# EAGLE design napajeniMOB (EAGLE 6.5.0)
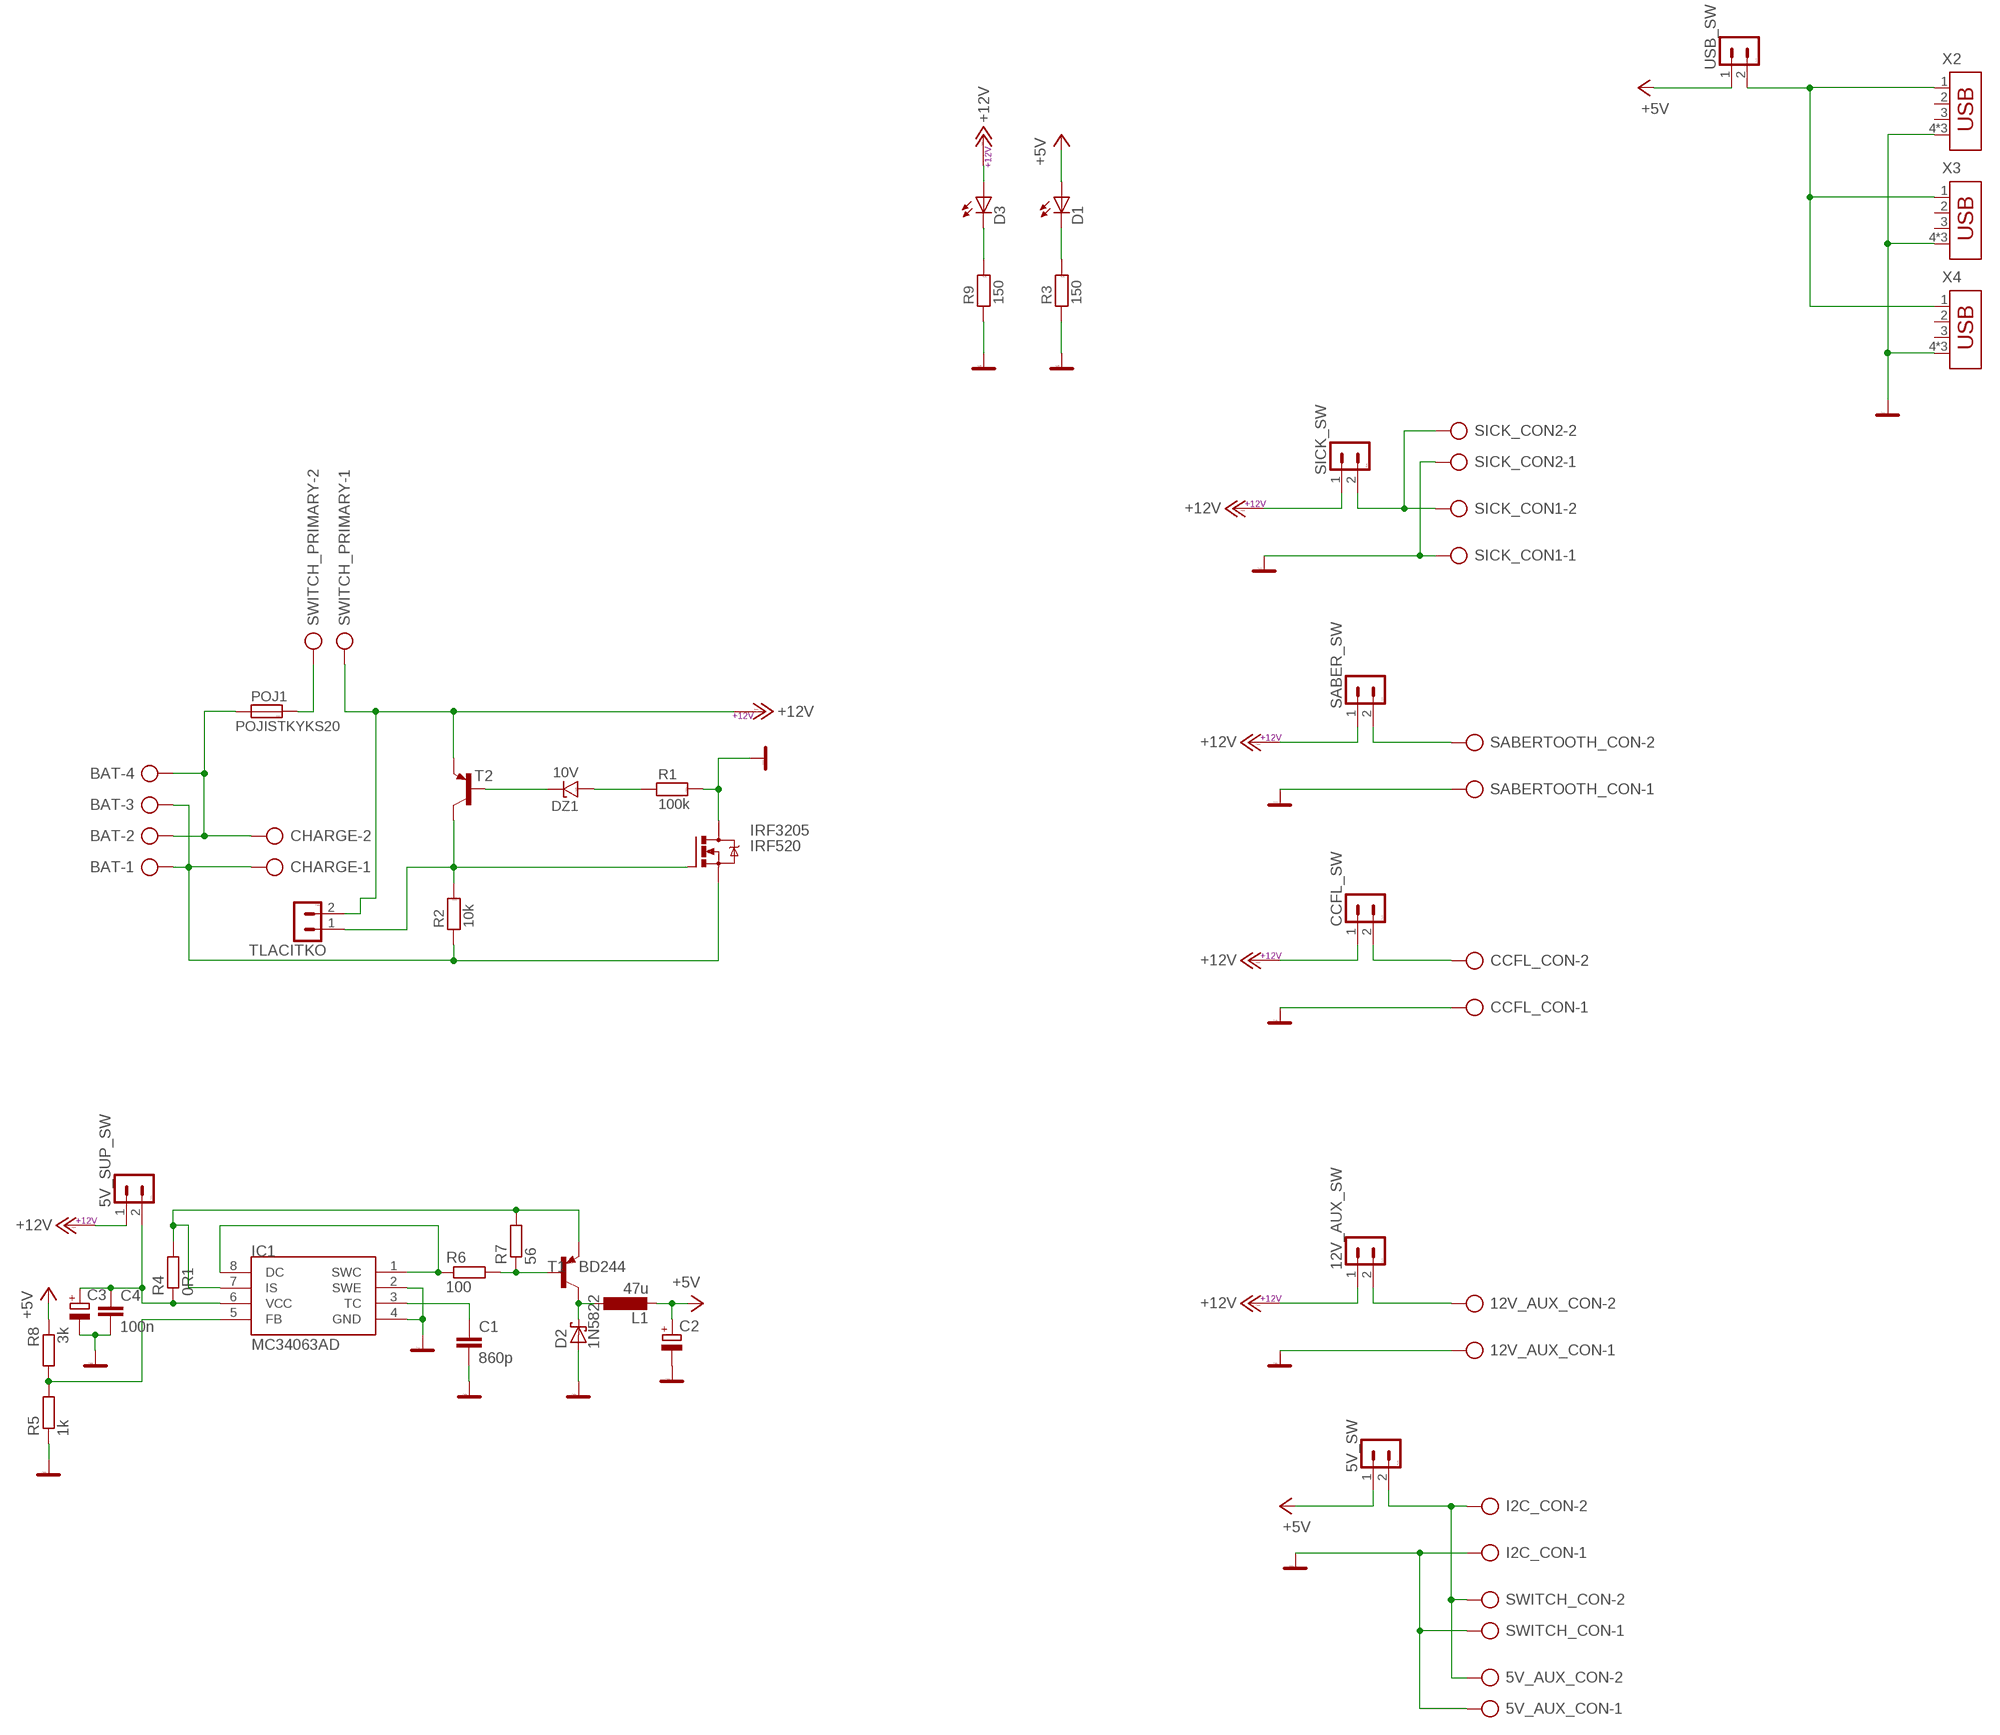
[diagram p0: schematic, sheet 1]

## Parts
5V_AUX_CON  AK500/2  [AK500/2]
5V_SUP_SW  PSH02-02P  [PSH02-02P]
5V_SW  PSH02-02P  [PSH02-02P]
12V_AUX_CON  AK500/2  [AK500/2]
12V_AUX_SW  PSH02-02P  [PSH02-02P]
BAT  AK500/4  [AK500/4]
C1  860p  C-EUC0805  [C0805]
C2  CPOL-EUE5-8.5  [E5-8,5]
C3  CPOL-EUE5-8.5  [E5-8,5]
C4  100n  C-EUC0805  [C0805]
CCFL_CON  AK500/2  [AK500/2]
CCFL_SW  PSH02-02P  [PSH02-02P]
CHARGE  AK500/2  [AK500/2]
D1  LED3MM  [LED3MM]
D2  1N5822  1N5817-B  [DO41-7.6]
D3  LED3MM  [LED3MM]
DZ1  10V  D-ZENEROVA_0,5W_BZV55C_SMD  [SOD-80]
I2C_CON  AK500/2  [AK500/2]
IC1  MC34063AD  [SOIC8]
IRF3205  IRF520  [TO220BV]
L1  47u  L-EUTJ3-U1  [TJ3-U1]
POJ1  POJISTKYKS20  [POJ_KS20]
R1  100k  R_SMD_0805  [0805]
R2  10k  R_SMD_0805  [0805]
R3  150  R_SMD_0805  [0805]
R4  0R1  R-EU_M0805  [M0805]
R5  1k  R-EU_M0805  [M0805]
R6  100  R-EU_M0805  [M0805]
R7  56  R-EU_M0805  [M0805]
R8  3k  R-EU_M0805  [M0805]
R9  150  R_SMD_0805  [0805]
SABER_SW  PSH02-02P  [PSH02-02P]
SABERTOOTH_CON  AK500/2  [AK500/2]
SICK_CON1  AK500/2  [AK500/2]
SICK_CON2  AK500/2  [AK500/2]
SICK_SW  PSH02-02P  [PSH02-02P]
SWITCH_CON  AK500/2  [AK500/2]
SWITCH_PRIMARY  AK500/2  [AK500/2]
T1  BD244  [TO220]
T2  BC807-16-PNP-SOT23-BEC  [SOT23-BEC]
TLACITKO  PSH02-02P  [PSH02-02P]
USB_SW  PSH02-02P  [PSH02-02P]
X2  USB-787616GROUNDED  [USBGROUNDED]
X3  USB-787616GROUNDED  [USBGROUNDED]
X4  USB-787616GROUNDED  [USBGROUNDED]

## Nets
+5V: 5V_SW.1 C2.+ D1.A L1.2 R8.1 USB_SW.1
+12V: 5V_SUP_SW.1 12V_AUX_SW.1 CCFL_SW.1 D3.A SABER_SW.1 SICK_SW.1 SWITCH_PRIMARY.1 T2.E TLACITKO.2
GND: 5V_AUX_CON.1 12V_AUX_CON.1 C1.2 C2.- C3.- C4.2 CCFL_CON.1 D2.A I2C_CON.1 IC1.2(SWE) IC1.4(GND) IRF3205.D R1.2 R3.1 R5.1 R9.1 SABERTOOTH_CON.1 SICK_CON1.1 SICK_CON2.1 SWITCH_CON.1 X2.4 X2.S1 X2.S2 X3.4 X3.S1 X3.S2 X4.4 X4.S1 X4.S2
GND_BATERIE: BAT.1 BAT.3 CHARGE.1 IRF3205.S R2.1
N$1: DZ1.A R1.1
N$2: BAT.2 BAT.4 CHARGE.2 POJ1.1
N$3: DZ1.K T2.B
N$4: POJ1.2 SWITCH_PRIMARY.2
N$5: IRF3205.G R2.2 T2.C TLACITKO.1
N$6: 5V_SUP_SW.2 C3.+ C4.1 IC1.6(VCC) R4.1
N$7: D3.K(C) R9.2
N$8: D1.K(C) R3.2
N$9: SICK_CON1.2 SICK_CON2.2 SICK_SW.2
N$10: USB_SW.2 X2.1 X3.1 X4.1
N$11: SABER_SW.2 SABERTOOTH_CON.2
N$12: CCFL_CON.2 CCFL_SW.2
N$13: D2.C L1.1 T1.2(C)
N$15: 12V_AUX_CON.2 12V_AUX_SW.2
N$16: 5V_AUX_CON.2 5V_SW.2 I2C_CON.2 SWITCH_CON.2
N$17: IC1.5(FB) R5.2 R8.2
N$18: IC1.7(IS) R4.2 R7.2 T1.3(E)
N$19: IC1.1(SWC) IC1.8(DC) R6.1
N$20: R6.2 R7.1 T1.1(B)
N$22: C1.1 IC1.3(TC)
Unconnected: X2.2 X2.3 X3.2 X3.3 X4.2 X4.3

## Library data of the parts
5V_AUX_CON 12V_AUX_CON CCFL_CON CHARGE I2C_CON SABERTOOTH_CON SICK_CON1 SICK_CON2 SWITCH_CON SWITCH_PRIMARY = #Svorkovnice:AK500/2: CONNECTOR
5V_SUP_SW 5V_SW 12V_AUX_SW CCFL_SW SABER_SW SICK_SW TLACITKO USB_SW = #PaJa_konektory:PSH02-02: Konektory se zamkem - vidlice - 2pin
BAT = #Svorkovnice:AK500/4: CONNECTOR
C1 C4 = rcl:C-EU: CAPACITOR, European symbol
C2 C3 = rcl:CPOL-EU: POLARIZED CAPACITOR, European symbol
D1 D3 = led:LED: LED OSRAM: - CHIPLED LG R971, LG N971, LY N971, LG Q971, LY Q971, LO R971, LY R971 LH N974, LH R974 LS Q976, LO Q976, LY Q976 LO Q996 - Hyper CHIPLED LW Q18S LB Q993, LB Q99A, LB R99A - SideLED LS A670, LO A670, LY A670, LG A670, LP A670 LB A673, LV A673, LT A673, LW A673 LH A674 LY A675 LS A676, LA A676, LO A676, LY A676, LW A676 LS A679, LY A679, LG A679 - Hyper Micro SIDELED® LS Y876, LA Y876, LO Y876, LY Y876 LT Y87S - SmartLED LW L88C, LW L88S LB L89C, LB L89S, LG L890 LS L89K, LO L89K, LY L89K LS L896, LA L896, LO L896, LY L896 - TOPLED LS T670, LO T670, LY T670, LG T670, LP T670 LSG T670, LSP T670, LSY T670, LOP T670, LYG T670 LG T671, LOG T671, LSG T671 LB T673, LV T673, LT T673, LW T673 LH T674 LS T676, LA T676, LO T676, LY T676, LB T676, LH T676, LSB T676, LW T676 LB T67C, LV T67C, LT T67C, LS T67K, LO T67K, LY T67K, LW E67C LS E67B, LA E67B, LO E67B, LY E67B, LB E67C, LV E67C, LT E67C LW T67C LS T679, LY T679, LG T679 LS T770, LO T770, LY T770, LG T770, LP T770 LB T773, LV T773, LT T773, LW T773 LH T774 LS E675, LA E675, LY E675, LS T675 LS T776, LA T776, LO T776, LY T776, LB T776 LHGB T686 LT T68C, LB T68C - Hyper Mini TOPLED® LB M676 - Mini TOPLED Santana® LG M470 LS M47K, LO M47K, LY M47K Source: http://www.osram.convergy.de LUXEON: - LUMILED® LXK2-PW12-R00, LXK2-PW12-S00, LXK2-PW14-U00, LXK2-PW14-V00 LXK2-PM12-R00, LXK2-PM12-S00, LXK2-PM14-U00 LXK2-PE12-Q00, LXK2-PE12-R00, LXK2-PE12-S00, LXK2-PE14-T00, LXK2-PE14-U00 LXK2-PB12-K00, LXK2-PB12-L00, LXK2-PB12-M00, LXK2-PB14-N00, LXK2-PB14-P00, LXK2-PB14-Q00 LXK2-PR12-L00, LXK2-PR12-M00, LXK2-PR14-Q00, LXK2-PR14-R00 LXK2-PD12-Q00, LXK2-PD12-R00, LXK2-PD12-S00 LXK2-PH12-R00, LXK2-PH12-S00 LXK2-PL12-P00, LXK2-PL12-Q00, LXK2-PL12-R00 Source: www.luxeon.com KINGBRIGHT: KA-3528ASYC Source: www.kingbright.com
D2 = diode:1N581*: 1.0A SCHOTTKY BARRIER RECTIFIER Source: http://www.diodes.com/datasheets/ds23001.pdf
DZ1 = #PaJa_30:D-ZENEROVA: Zenerova dioda
IC1 = mc34063:MC34063
IRF3205 = transistor-power:IRF520: HEXFET Power MOSFET
L1 = rcl:L-EU: INDUCTOR, European symbol
POJ1 = #PaJa_30:POJISTKY: Pojistkove pouzdro
R1-R3 R9 = #PaJa_30:R: Rezistor
R4-R8 = rcl:R-EU_: RESISTOR, European symbol
T1 = transistor:BD244: PNP TRANSISTOR Source: Motorola Semiconductor, Master Selection Guide Q3/95 SG73 REV 8 page 5.5-5
T2 = transistor:*-PNP-: PNP Transistror
X2-X4 = D-USBcon:USB-787616GROUNDED: AMP connector

## Board
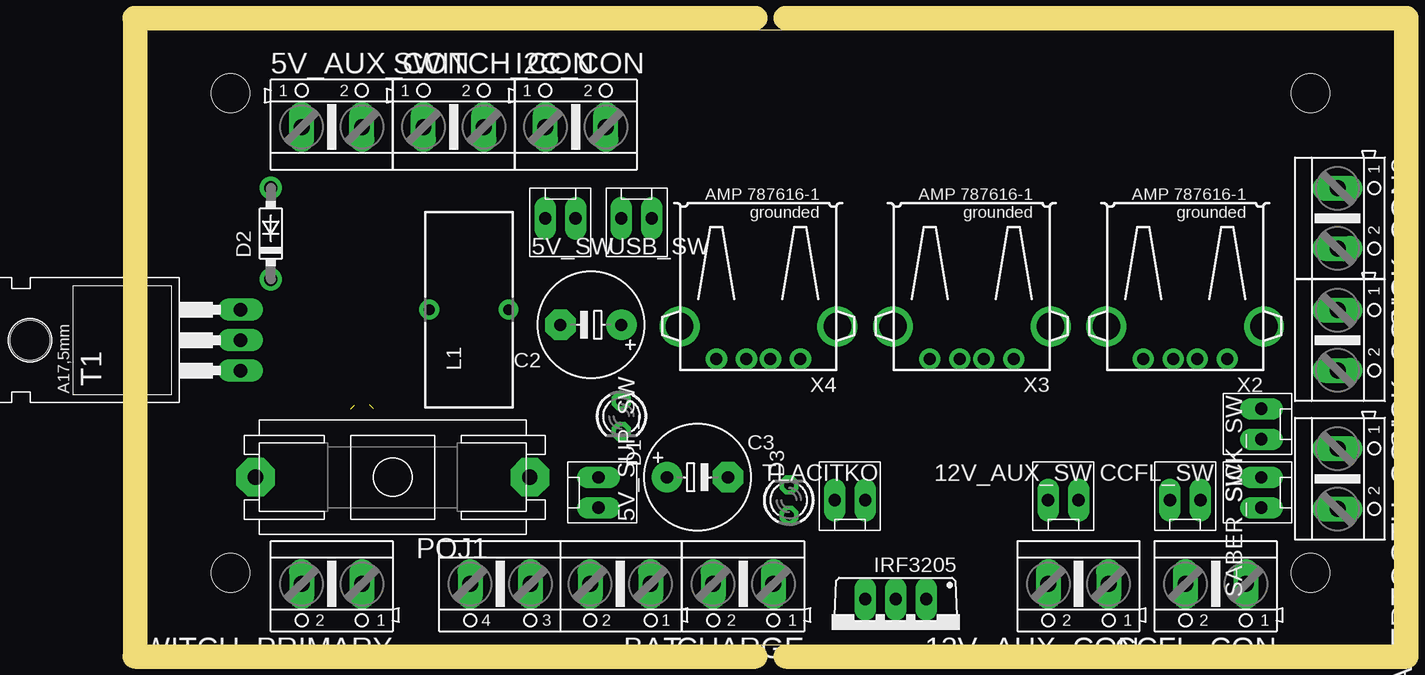
[diagram p1: board, top side]
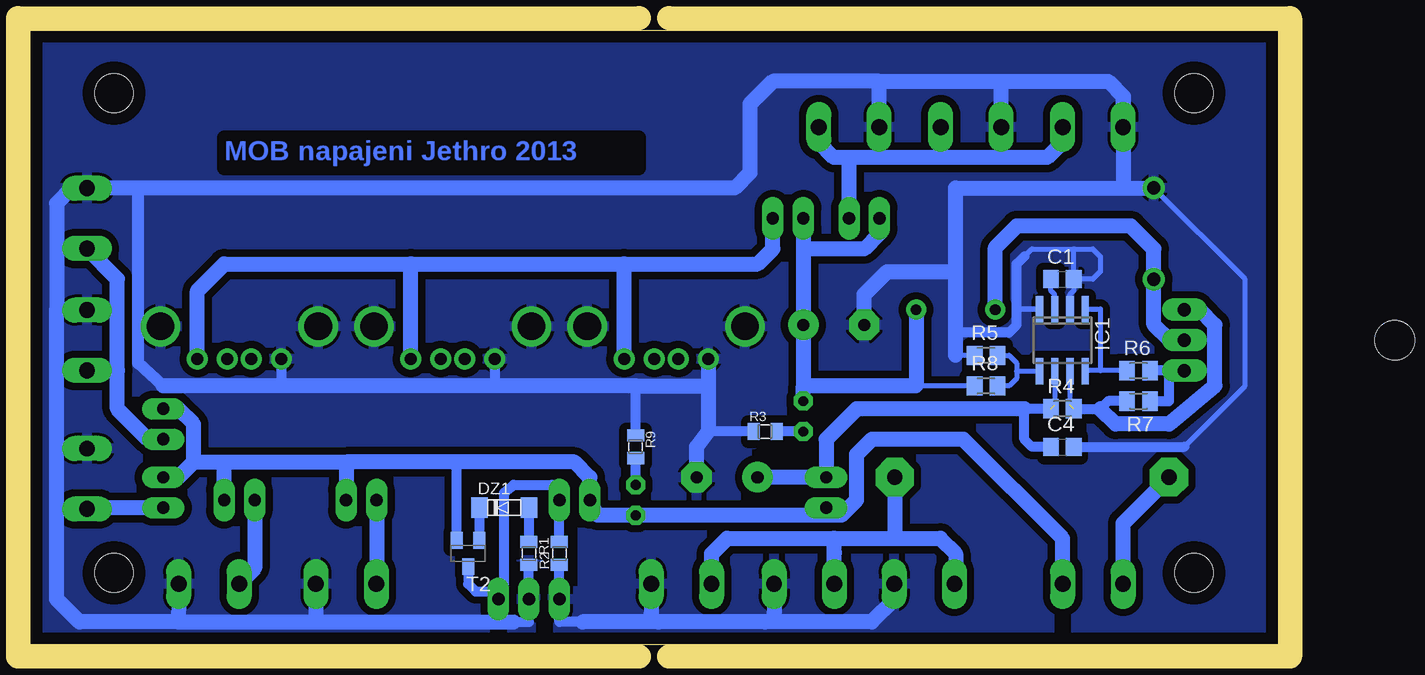
[diagram p2: board, bottom side, seen from below]

Size 104 x 51.27 mm. Coordinates in mm from the lower left corner, seen from the top.
Outline: 0,0 104,0 104,51.27 0,51.27 0,0
Copper layers (1*16): Top 0.035mm / dielectric 1.5mm / Bottom 0.035mm
Design rules "default *": minimum track width 10mil, minimum drill 24mil, track to track 8mil, track to pad 8mil, pad to pad 8mil, via to via 8mil, smd to smd 8mil, copper to edge 40mil, drill to drill 8mil, minimum pad ring 15mil, minimum via ring 8mil, stop-mask expansion 4mil, vias tented up to drill 0mil, thermal gap 10mil
Holes 3.2 mm at 7,6 97,6 97,46 7,46
bRestrict: area 41.3,17 to 44.1,18.5; area 52.8,15.1 to 54.3,17.9; area 22.7,23.2 to 25.7,25; area 22.8,20.7 to 25.8,22.5; area 61.1,5.1 to 63.7,6.4; area 53.3,39.8 to 87.8,42.3; area 16.4,15.6 to 19.5,17.4; area 61,0.6 to 61.2,3.2; area 17.8,0.6 to 18,3.2; 1 lines
Milling: 6 lines

### Footprints (pad centres in the part's own frame; a part is rotated, then mirrored left to right if it is on the bottom)
AK500/2 = drill 1.321 long: 1 -2.515,0; 2 2.515,0
PSH02-02P = drill 1.016 pad 1.422 long: 1 -1.27,0; 2 1.27,0
AK500/4 = drill 1.321 long: 1 -7.518,0; 2 -2.489,0; 3 2.489,0; 4 7.518,0
C0805 = smd 1.3 x 1.5: 1 -0.95,0; 2 0.95,0
E5-8,5 = drill 1.016 pad 2.54: + -2.54,0 | drill 1.016 pad 2.54 octagon: - 2.54,0
LED3MM = drill 0.813 octagon: A -1.27,0; K 1.27,0
DO41-7.6 = drill 1.1 pad 1.7: A 3.81,0; C -3.81,0
SOD-80 = smd 1.397 x 1.702: A 1.905,0; K -2.223,0
SOIC8 = smd 0.6 x 2.2: 1 -1.905,-2.6; 2 -0.635,-2.6; 3 0.635,-2.6; 4 1.905,-2.6; 5 1.905,2.6; 6 0.635,2.6; 7 -0.635,2.6; 8 -1.905,2.6
TO220BV = drill 1.016 long: D 0,-2.54; G -2.54,-2.54; S 2.54,-2.54
TJ3-U1 = drill 0.9: 1 -3.3,0; 2 3.3,0
POJ_KS20 = drill 1.27 pad 3.2 octagon: 1 -11.43,0; 2 11.43,0
0805 = smd 1.016 x 1.422: 1 -0.953,0; 2 0.953,0
M0805 = smd 1.3 x 1.6: 1 -0.95,0; 2 0.95,0
TO220 = drill 1.118 long: 1 -2.54,-6.35; 2 0,-6.35; 3 2.54,-6.35 | hole 3.302: 0,11.176
SOT23-BEC = smd 1 x 1.4: B -0.95,-1.1; C 0,1.1; E 0.95,-1.1
USBGROUNDED = drill 1: 1 -3.5,12.99; 2 -1,12.99; 3 1,12.99; 4 3.5,12.99 | drill 2.3: S1 -6.57,10.28; S2 6.57,10.28

### Placement (x,y rotation side)
5V_AUX_CON  15.43,43.18 0 top
5V_SUP_SW  37.66,12.7 90 top
5V_SW  34.48,35.56 0 top
12V_AUX_CON  77.66,5.08 180 top
12V_AUX_SW  76.39,12.07 180 top
BAT  34.48,5.08 180 top
C1  17.97,30.48 0 bottom
C2  37.02,26.67 180 top
C3  45.91,13.97 0 top
C4  17.97,16.51 0 bottom
CCFL_CON  89.09,5.08 180 top
CCFL_SW  86.55,12.07 180 top
CHARGE  49.72,5.08 180 top
D1  39.56,19.05 270 top
D2  10.35,34.29 90 top
D3  53.53,12.07 90 top
DZ1  64.32,11.43 0 bottom
I2C_CON  35.75,43.18 0 top
IC1  17.97,25.4 180 bottom
IRF3205  62.42,1.27 180 top
L1  26.86,27.94 0 top
POJ1  20.51,13.97 180 top
R1  62.42,7.62 270 bottom
R2  59.88,7.62 90 bottom
R3  42.73,17.78 0 bottom
R4  17.97,19.69 0 bottom
R5  24.32,24.13 0 bottom
R6  11.62,22.86 0 bottom
R7  11.62,20.32 180 bottom
R8  24.32,21.59 0 bottom
R9  53.53,16.51 270 bottom
SABER_SW  92.9,12.7 270 top
SABERTOOTH_CON  99.25,13.84 270 top
SICK_CON1  99.25,25.4 270 top
SICK_CON2  99.25,35.56 270 top
SICK_SW  92.9,18.41 270 top
SWITCH_CON  25.59,43.18 0 top
SWITCH_PRIMARY  15.43,5.08 180 top
T1  1.46,25.4 90 top
T2  67.5,7.62 180 bottom
TLACITKO  58.61,12.07 180 top
USB_SW  40.83,35.56 0 top
X2  86.55,36.83 180 top
X3  68.77,36.83 180 top
X4  50.99,36.83 180 top

### Tracks (layer width: path | path; a pad name or v marks a point on that pad's centre or on a via)
+5V
  Bottom 0.406: R8.1 31.3,21.59
  Bottom 1.27: 5V_SW.1 33.21,34.29 34.48,33.02 39.56,33.02 | USB_SW.1 39.56,33.02 | 39.56,33.02 C2.+ 39.56,21.59 | D1.A 39.56,21.59 | 39.56,21.59 31.3,21.59 30.16,21.59 L1.2
+12V
  Bottom 0.406: 5V_SUP_SW.1 37.02,10.8
  Bottom 0.813: T2.E 68.45,14.93 68.77,15.24
  Bottom 1.27: 90.36,15.24 87.82,15.24 | 87.82,15.24 77.66,15.24 | 77.66,15.24 12V_AUX_SW.1 | CCFL_SW.1 87.82,15.24 | SABER_SW.1 91.63,13.97 90.36,15.24 | 77.66,15.24 68.77,15.24 58.61,15.24 57.34,13.97 TLACITKO.2 56.71,10.8 D3.A 37.02,10.8 36.38,10.8 35.12,12.07 35.12,15.88 33.84,17.14 26.23,17.14 17.95,8.86 SWITCH_PRIMARY.1 | 90.36,15.24 90.36,18.41 91.63,19.69 SICK_SW.1
GND
  Bottom 0.406: R5.1 26.86,24.13 | IC1.2 17.34,29.21 17.02,29.52 C1.2 17.02,33.02 | 16.7,30.48 15.43,30.48 14.8,31.12 14.8,32.38 15.43,33.02 17.02,33.02 | 21.78,31.75 20.51,33.02 17.02,33.02 | 7.81,16.51 2.73,21.59 2.73,30.48 D2.A | IC1.4 21.72,28 21.78,27.94 19.88,27.94 IC1.4
  Bottom 0.813: R1.2 IRF3205.D 62.42,1.91 63.69,1.91 | 21.14,32.38 21.78,31.75 21.78,27.94 21.78,26.67 22.41,26.04 26.86,26.04 | X3.4 65.27,21.91 | X2.4 83.05,21.91 83.38,21.59 | R3.1 47.49,17.78 | C4.2 7.81,16.51 | R9.1 53.53,21.59
  Bottom 1.016: 92.9,21.59 95,23.5 95,38.1
  Bottom 1.27: 91.63,1.91 91.6,3.79 CCFL_CON.1 91.6,3.83 91.63,1.91 | 91.63,1.91 80.2,1.91 | 80.2,3.81 80.2,1.91 | 80.2,1.91 63.69,1.91 | SICK_CON1.1 100.5,27.91 100.52,27.94 101.79,27.94 | C2.- 34.48,29.21 32.58,31.12 26.86,31.12 | 26.86,31.12 26.86,38.1 12.89,38.1 | SABERTOOTH_CON.1 101.64,16.36 | 101.64,16.36 101.79,16.51 | 101.79,16.51 101.79,16.84 | 101.79,16.84 101.79,27.94 | 91.63,1.91 99.88,1.91 101.79,3.81 101.79,16.51 | 101.79,16.84 101.64,16.36 | 26.86,24.13 26.86,26.04 26.86,31.12 | I2C_CON.1 33.21,43.16 33.21,46.99 | 33.21,46.99 42.1,46.99 44.01,45.09 44.01,39.37 45.27,38.1 95,38.1 99.22,38.1 SICK_CON2.1 100.54,38.08 101.79,36.83 101.79,27.94 | 33.21,46.99 23.05,46.99 | 23.05,46.99 14.16,46.99 12.89,45.72 | 12.89,45.72 12.89,38.1 | 12.89,38.1 D2.A | SWITCH_CON.1 23.07,46.97 23.05,46.99 | 5V_AUX_CON.1 12.91,45.7 12.89,45.72 | 92.9,21.59 83.38,21.59 53.53,21.59 47.49,21.59 | C3.- 48.45,16.51 47.49,17.78 47.49,21.59 | X4.4 47.49,21.59
  pour Bottom (isolate 0.61, rank 6): 0,51.27 104,51.27 104,0 0,0
GND_BATERIE
  Bottom 0.406: 52.23,2.57 51.62,1.91 | 42,2.64 42.73,1.91
  Bottom 0.813: R2.1 IRF3205.S 59.88,1.91 57.98,1.91
  Bottom 1.27: BAT.3 31.99,3.76 33.84,1.91 42.73,1.91 51.62,1.91 57.98,1.91 | CHARGE.1 52.23,2.57 | BAT.1 42,2.64
  pour Bottom (isolate 0.61): 18.61,0 18.61,8.89 26.23,17.14 35.12,17.14 35.12,10.8 57.98,10.73 57.98,4.45 60.51,4.45 60.51,0
N$1
  Bottom 0.813: DZ1.A R1.1
N$2
  Bottom 0.406: 26.86,5.18 BAT.4
  Bottom 1.27: 26.86,5.08 26.86,5.18 26.86,7.62 28.13,8.89 31.94,8.89 | BAT.2 36.97,7.67 37.02,8.89 | 37.02,8.89 31.94,8.89 | CHARGE.2 47.2,7.59 45.91,8.89 37.02,8.89 | POJ1.1 31.94,8.89
N$3
  Bottom 0.813: DZ1.K T2.B
N$4
  Bottom 1.27: SWITCH_PRIMARY.2 12.91,10.14 POJ1.2
N$5
  Bottom 0.813: IRF3205.G 64.96,4.45 | 64.96,4.45 64.48,5.08 64.48,12.7 63.69,13.34 60.51,13.34 59.88,12.7 TLACITKO.1 R2.2 | T2.C 67.5,5.08 66.87,4.45 64.96,4.45
N$6  (1 unrouted)
  Bottom 0.406: IC1.6 18.61,20
  Bottom 0.813: R4.1 21.14,19.69 21.14,17.14 20.51,16.51 C4.1
  Bottom 1.27: 21.14,19.69 35.12,19.69 37.66,17.14 5V_SUP_SW.2 C3.+
N$7
  Bottom 0.813: D3.K R9.2
N$8
  Bottom 0.813: D1.K R3.2
N$9
  Bottom 1.27: SICK_CON1.2 97.96,22.89 | 97.96,22.89 96.71,22.86 | SICK_SW.2 94.17,17.14 96.71,19.69 96.71,22.86 | 96.71,22.86 96.71,22.91 | 96.71,22.91 97.96,22.89 | 96.71,22.91 96.71,30.51 SICK_CON2.2
N$10
  Bottom 1.27: USB_SW.2 42.1,33.02 43.37,31.75 54.49,31.75 | 72.27,31.75 87.82,31.75 90.05,29.52 X2.1 | 72.27,31.75 54.49,31.75 | X4.1 54.49,31.75 | X3.1 72.27,31.75
N$11
  Bottom 1.27: SABER_SW.2 98.51,11.43 SABERTOOTH_CON.2
N$12
  Bottom 1.27: CCFL_SW.2 85.28,6.37 CCFL_CON.2
N$13
  Bottom 1.27: T1.2 9.08,25.4 10.35,26.67 D2.C 10.35,33.02 12.25,34.93 21.78,34.93 23.56,33.15 L1.1
N$15
  Bottom 0.406: 75.12,5.1 12V_AUX_CON.2
  Bottom 1.27: 12V_AUX_SW.2 75.12,5.1
N$16
  Bottom 1.27: 5V_SW.2 35.75,40.64 | 35.75,40.64 37.02,40.64 38.29,41.91 38.29,43.16 I2C_CON.2 | 5V_AUX_CON.2 17.95,41.94 19.24,40.64 28.13,40.64 | 28.13,40.64 35.75,40.64 | SWITCH_CON.2 28.1,43.2 28.13,40.64
N$17
  Bottom 0.406: IC1.5 21.78,22.8 | R8.2 22.41,21.59 21.78,22.23 21.78,22.8 | R5.2 22.41,24.13 21.78,23.5 21.78,22.8
N$18  (1 unrouted)
  Bottom 0.406: IC1.7 17.34,20
  Bottom 0.813: R7.2 14.16,20.32 14.8,19.69 R4.2
  Bottom 1.27: T1.3 6.54,27.94 5.27,26.67 5.27,21.59 9.08,18.41 13.52,18.41 14.8,19.69
N$19
  Bottom 0.406: IC1.1 14.8,28 14.8,22.86 | R6.1 14.8,22.86 | 14.8,22.86 16,22.86 IC1.8
N$20
  Bottom 0.813: T1.1 9.08,22.86 | 9.08,22.86 R6.2 | R7.1 9.08,20.32 9.08,22.86
N$22
  Bottom 0.406: IC1.3 18.61,29.21 18.92,29.52 C1.1

### Text on the board
Bottom: MOB napajeni Jethro 2013